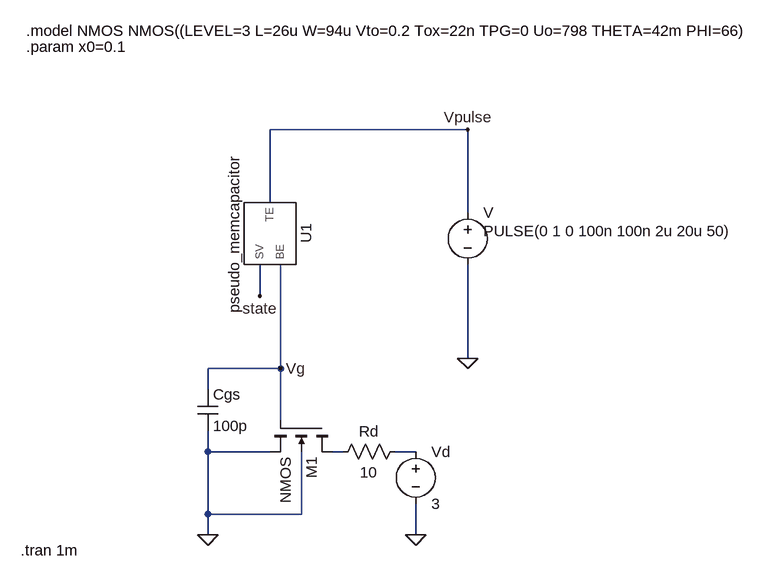
[diagram p0: schematic neuro_memristor.asc]
neuro_memristor.asc, the LTspice schematic file:
Version 4
SHEET 1 1936 1012
WIRE 752 -224 448 -224
WIRE 448 -112 448 -224
WIRE 752 -96 752 -224
WIRE 432 32 432 -16
WIRE 752 128 752 -16
WIRE 464 144 464 -16
WIRE 464 144 352 144
WIRE 352 176 352 144
WIRE 464 224 464 144
WIRE 352 272 352 240
WIRE 448 272 352 272
WIRE 560 272 544 272
WIRE 672 272 640 272
WIRE 352 368 352 272
WIRE 496 368 496 272
WIRE 496 368 352 368
WIRE 352 400 352 368
WIRE 672 400 672 352
FLAG 752 128 0
FLAG 672 400 0
FLAG 352 400 0
FLAG 432 32 state
FLAG 752 -224 Vpulse
FLAG 464 144 Vg
SYMBOL voltage 752 -112 R0
WINDOW 123 0 0 Left 0
WINDOW 39 0 0 Left 0
WINDOW 3 24 44 Left 2
SYMATTR Value PULSE(0 1 0 100n 100n 2u 20u 50)
SYMATTR InstName V
SYMBOL cap 336 176 R0
SYMATTR InstName Cgs
SYMATTR Value 100p
SYMBOL nmos4 544 224 R90
SYMATTR InstName M1
SYMBOL voltage 672 256 R0
SYMATTR InstName Vd
SYMATTR Value 3
SYMBOL res 656 256 R90
WINDOW 0 0 56 VBottom 2
WINDOW 3 32 56 VTop 2
SYMATTR InstName Rd
SYMATTR Value 10
SYMBOL pseudo_memcapacitor 448 -64 R90
SYMATTR InstName U1
TEXT 72 -376 Left 2 !.model NMOS NMOS((LEVEL=3 L=26u W=94u Vto=0.2 Tox=22n TPG=0 Uo=798 THETA=42m PHI=66)
TEXT 64 424 Left 2 !.tran 1m
TEXT 72 -352 Left 2 !.param x0=0.1

The netlist it stands for:
* neuro_memristor.asc
V Vpulse 0 PULSE(0 1 0 100n 100n 2u 20u 50)
Cgs Vg 0 100p
M1 N001 Vg 0 0 NMOS
Vd N002 0 3
Rd N002 N001 10
XU1 Vpulse Vg state pseudo_memcapacitor  ; pins TE BE SV
.model NMOS NMOS
.model PMOS PMOS
.lib standard.mos
.model NMOS NMOS((LEVEL=3 L=26u W=94u Vto=0.2 Tox=22n TPG=0 Uo=798 THETA=42m PHI=66)
.tran 1m
.param x0=0.1
.lib .\pseudo_memcapacitor.cir
.backanno
.end